# EAGLE schematic teensy32_design_block (EAGLE 9.6.2)
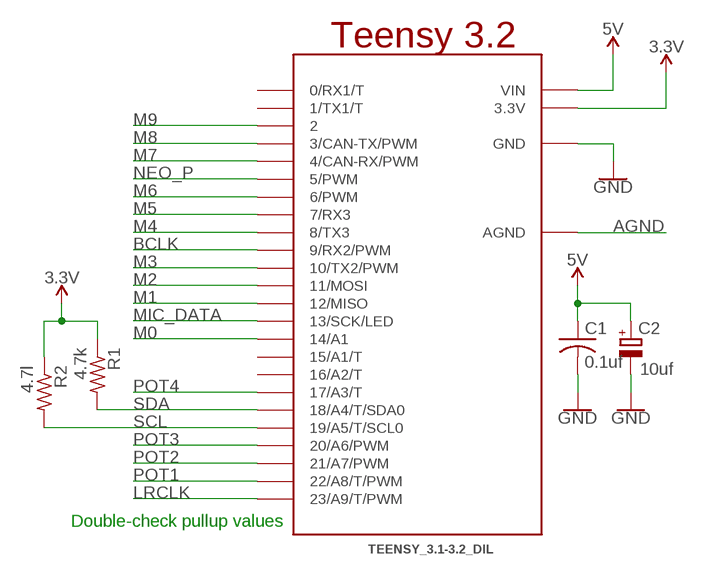
[diagram p0: schematic, sheet 1]

## Parts
C1  0.1uf  C-USC0805K  [C0805K]
C2  10uf  CPOL-EUE2.5-7  [E2,5-7]
R1  4.7k  R-US_R0805  [R0805]
R2  4.7l  R-US_R0805  [R0805]
U$3  TEENSY_3.1-3.2_DIL  [TEENSY_3.0-3.2&LC_DIL]

## Nets
3.3V: R1.1 R2.1 U$3.3.3V
5V: C1.1 C2.+ U$3.VIN
AGND: U$3.AGND
BCLK: U$3.9(9/RX2/PWM)
GND: C1.2 C2.- U$3.GND
LRCLK: U$3.23/A9(23/A9/T/PWM)
M0: U$3.14/A0(14/A1)
M1: U$3.12(12/MISO)
M2: U$3.11(11/MOSI)
M3: U$3.10(10/TX2/PWM)
M4: U$3.8(8/TX3)
M5: U$3.7(7/RX3)
M6: U$3.6(6/PWM)
M7: U$3.4(4/CAN-RX/PWM)
M8: U$3.3(3/CAN-TX/PWM)
M9: U$3.2
MIC_DATA: U$3.13(13/SCK/LED)
NEO_P: U$3.5(5/PWM)
POT1: U$3.22/A8(22/A8/T/PWM)
POT2: U$3.21/A7(21/A7/PWM)
POT3: U$3.20/A6(20/A6/PWM)
POT4: U$3.17/A3(17/A3/T)
SCL: R2.2 U$3.19/A5(19/A5/T/SCL0)
SDA: R1.2 U$3.18/A4(18/A4/T/SDA0)
Unconnected: U$3.0(0/RX1/T) U$3.1(1/TX1/T) U$3.15/A1(15/A1/T) U$3.16/A2(16/A2/T)

## Notes on the sheet
- Teensy 3.2
- Double-check pullup values

## Library data of the parts
C1 = resistor:C-US: CAPACITOR, American symbol
C2 = rcl:CPOL-EU: POLARIZED CAPACITOR, European symbol; SPICEPREFIX: C
R1 R2 = audio amplifier example:R-US_: RESISTOR, American symbol
U$3 = Teensy_3_and_LC_Series_Boards_v1.4:TEENSY_3.1-3.2_DIL: Teensy 3.1 or 3.2 in a DIL Layout.

## Net classes
0 default: width 0.203 mm, drill 0.254 mm, clearance 0.152 mm